# EAGLE design Pots (EAGLE 7.4.0)
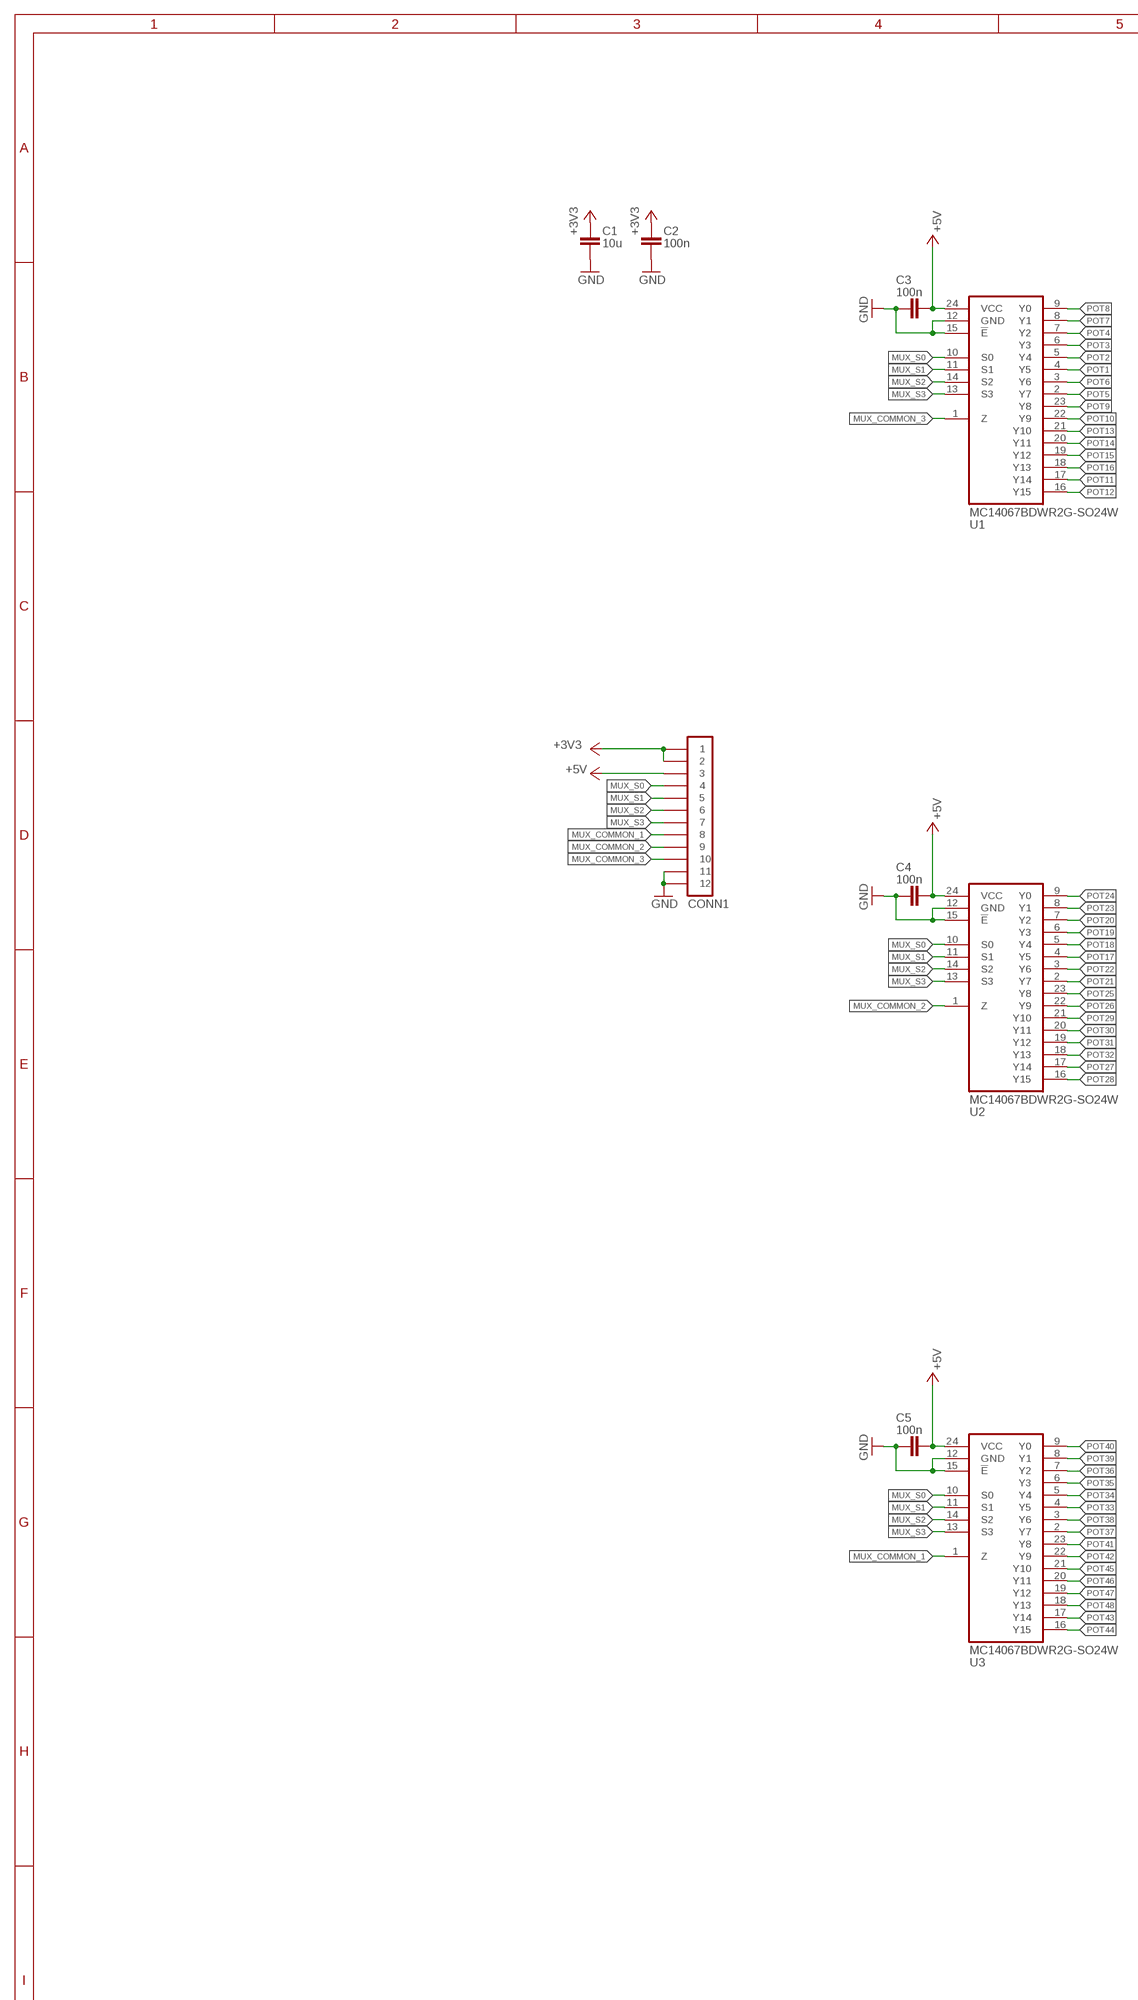
[diagram p0: schematic, sheet 1, part 1 of 2]
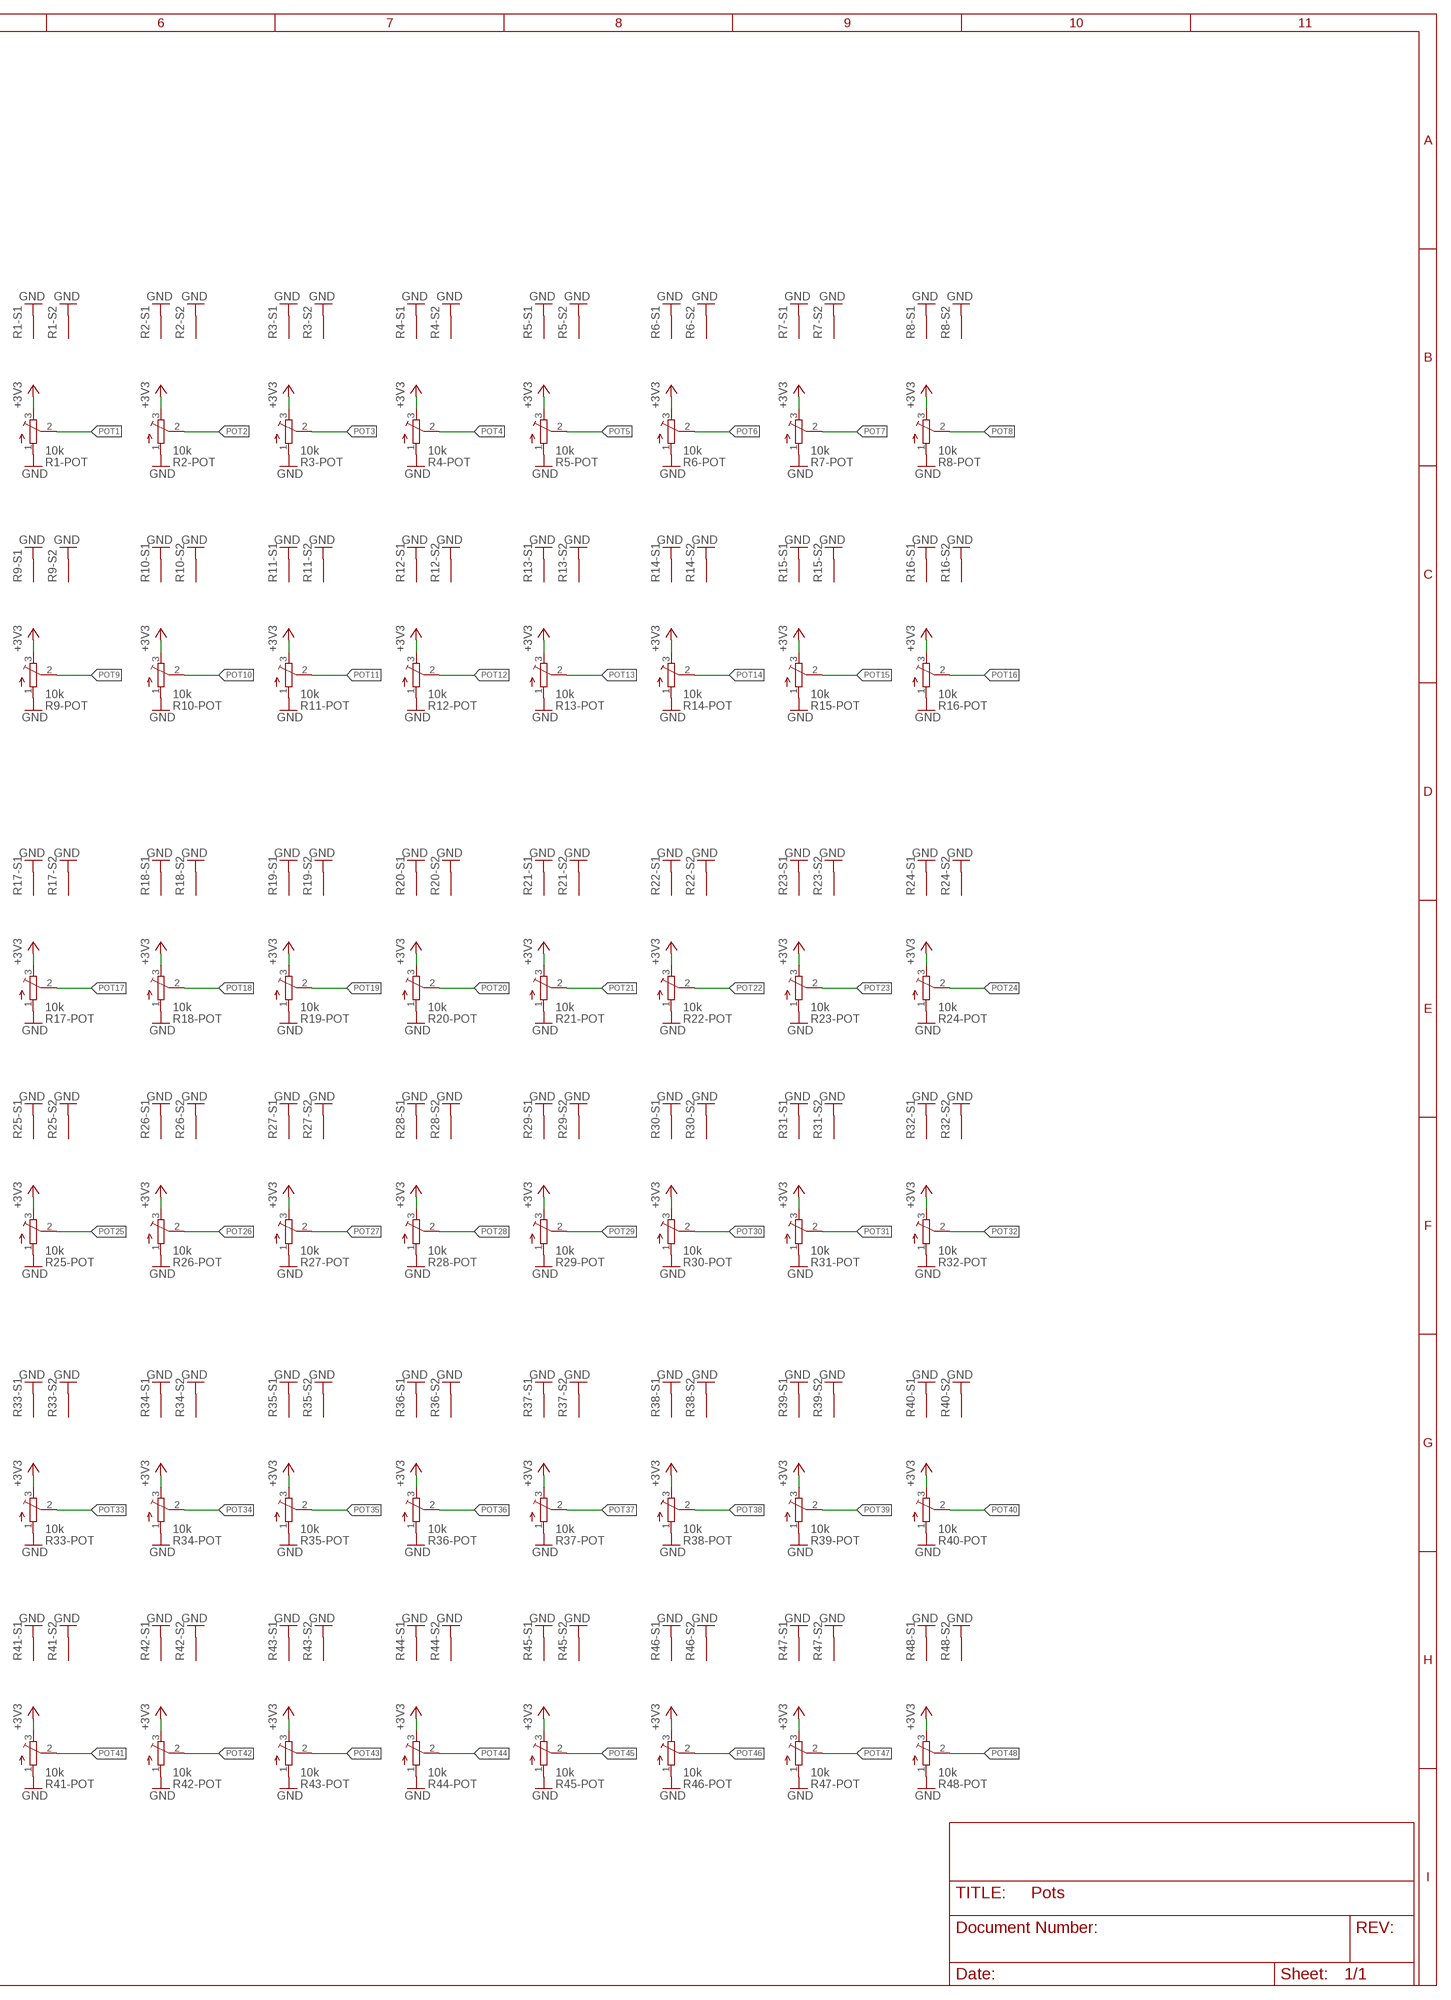
[diagram p1: schematic, sheet 1, part 2 of 2]

## Parts
C1  10u  CAPACITOR-0805  [C0805]
C2  100n  CAPACITOR-0805  [C0805]
C3  100n  CAPACITOR-0805  [C0805]
C4  100n  CAPACITOR-0805  [C0805]
C5  100n  CAPACITOR-0805  [C0805]
CONN1  PINHD-1X12-SMD  [MOLEX-52271-1279]
R1  10k  PTV09A-4025F-B103  [PTV09A-4025F-B103]
R2  10k  PTV09A-4025F-B103  [PTV09A-4025F-B103]
R3  10k  PTV09A-4025F-B103  [PTV09A-4025F-B103]
R4  10k  PTV09A-4025F-B103  [PTV09A-4025F-B103]
R5  10k  PTV09A-4025F-B103  [PTV09A-4025F-B103]
R6  10k  PTV09A-4025F-B103  [PTV09A-4025F-B103]
R7  10k  PTV09A-4025F-B103  [PTV09A-4025F-B103]
R8  10k  PTV09A-4025F-B103  [PTV09A-4025F-B103]
R9  10k  PTV09A-4025F-B103  [PTV09A-4025F-B103]
R10  10k  PTV09A-4025F-B103  [PTV09A-4025F-B103]
R11  10k  PTV09A-4025F-B103  [PTV09A-4025F-B103]
R12  10k  PTV09A-4025F-B103  [PTV09A-4025F-B103]
R13  10k  PTV09A-4025F-B103  [PTV09A-4025F-B103]
R14  10k  PTV09A-4025F-B103  [PTV09A-4025F-B103]
R15  10k  PTV09A-4025F-B103  [PTV09A-4025F-B103]
R16  10k  PTV09A-4025F-B103  [PTV09A-4025F-B103]
R17  10k  PTV09A-4025F-B103  [PTV09A-4025F-B103]
R18  10k  PTV09A-4025F-B103  [PTV09A-4025F-B103]
R19  10k  PTV09A-4025F-B103  [PTV09A-4025F-B103]
R20  10k  PTV09A-4025F-B103  [PTV09A-4025F-B103]
R21  10k  PTV09A-4025F-B103  [PTV09A-4025F-B103]
R22  10k  PTV09A-4025F-B103  [PTV09A-4025F-B103]
R23  10k  PTV09A-4025F-B103  [PTV09A-4025F-B103]
R24  10k  PTV09A-4025F-B103  [PTV09A-4025F-B103]
R25  10k  PTV09A-4025F-B103  [PTV09A-4025F-B103]
R26  10k  PTV09A-4025F-B103  [PTV09A-4025F-B103]
R27  10k  PTV09A-4025F-B103  [PTV09A-4025F-B103]
R28  10k  PTV09A-4025F-B103  [PTV09A-4025F-B103]
R29  10k  PTV09A-4025F-B103  [PTV09A-4025F-B103]
R30  10k  PTV09A-4025F-B103  [PTV09A-4025F-B103]
R31  10k  PTV09A-4025F-B103  [PTV09A-4025F-B103]
R32  10k  PTV09A-4025F-B103  [PTV09A-4025F-B103]
R33  10k  PTV09A-4025F-B103  [PTV09A-4025F-B103]
R34  10k  PTV09A-4025F-B103  [PTV09A-4025F-B103]
R35  10k  PTV09A-4025F-B103  [PTV09A-4025F-B103]
R36  10k  PTV09A-4025F-B103  [PTV09A-4025F-B103]
R37  10k  PTV09A-4025F-B103  [PTV09A-4025F-B103]
R38  10k  PTV09A-4025F-B103  [PTV09A-4025F-B103]
R39  10k  PTV09A-4025F-B103  [PTV09A-4025F-B103]
R40  10k  PTV09A-4025F-B103  [PTV09A-4025F-B103]
R41  10k  PTV09A-4025F-B103  [PTV09A-4025F-B103]
R42  10k  PTV09A-4025F-B103  [PTV09A-4025F-B103]
R43  10k  PTV09A-4025F-B103  [PTV09A-4025F-B103]
R44  10k  PTV09A-4025F-B103  [PTV09A-4025F-B103]
R45  10k  PTV09A-4025F-B103  [PTV09A-4025F-B103]
R46  10k  PTV09A-4025F-B103  [PTV09A-4025F-B103]
R47  10k  PTV09A-4025F-B103  [PTV09A-4025F-B103]
R48  10k  PTV09A-4025F-B103  [PTV09A-4025F-B103]
U1  MC14067BDWR2G-SO24W  [SO24-W]
U2  MC14067BDWR2G-SO24W  [SO24-W]
U3  MC14067BDWR2G-SO24W  [SO24-W]

## Nets
+3V3: C1.1 C2.1 CONN1.1 CONN1.2 R1.3 R2.3 R3.3 R4.3 R5.3 R6.3 R7.3 R8.3 R9.3 R10.3 R11.3 R12.3 R13.3 R14.3 R15.3 R16.3 R17.3 R18.3 R19.3 R20.3 R21.3 R22.3 R23.3 R24.3 R25.3 R26.3 R27.3 R28.3 R29.3 R30.3 R31.3 R32.3 R33.3 R34.3 R35.3 R36.3 R37.3 R38.3 R39.3 R40.3 R41.3 R42.3 R43.3 R44.3 R45.3 R46.3 R47.3 R48.3
+5V: C3.2 C4.2 C5.2 CONN1.3 U1.24(VCC) U2.24(VCC) U3.24(VCC)
GND: C1.2 C2.2 C3.1 C4.1 C5.1 CONN1.11 CONN1.12 R1.1 R1.S1(-S1:S) R1.S2(-S2:S) R2.1 R2.S1(-S1:S) R2.S2(-S2:S) R3.1 R3.S1(-S1:S) R3.S2(-S2:S) R4.1 R4.S1(-S1:S) R4.S2(-S2:S) R5.1 R5.S1(-S1:S) R5.S2(-S2:S) R6.1 R6.S1(-S1:S) R6.S2(-S2:S) R7.1 R7.S1(-S1:S) R7.S2(-S2:S) R8.1 R8.S1(-S1:S) R8.S2(-S2:S) R9.1 R9.S1(-S1:S) R9.S2(-S2:S) R10.1 R10.S1(-S1:S) R10.S2(-S2:S) R11.1 R11.S1(-S1:S) R11.S2(-S2:S) R12.1 R12.S1(-S1:S) R12.S2(-S2:S) R13.1 R13.S1(-S1:S) R13.S2(-S2:S) R14.1 R14.S1(-S1:S) R14.S2(-S2:S) R15.1 R15.S1(-S1:S) R15.S2(-S2:S) R16.1 R16.S1(-S1:S) R16.S2(-S2:S) R17.1 R17.S1(-S1:S) R17.S2(-S2:S) R18.1 R18.S1(-S1:S) R18.S2(-S2:S) R19.1 R19.S1(-S1:S) R19.S2(-S2:S) R20.1 R20.S1(-S1:S) R20.S2(-S2:S) R21.1 R21.S1(-S1:S) R21.S2(-S2:S) R22.1 R22.S1(-S1:S) R22.S2(-S2:S) R23.1 R23.S1(-S1:S) R23.S2(-S2:S) R24.1 R24.S1(-S1:S) R24.S2(-S2:S) R25.1 R25.S1(-S1:S) R25.S2(-S2:S) R26.1 R26.S1(-S1:S) R26.S2(-S2:S) R27.1 R27.S1(-S1:S) R27.S2(-S2:S) R28.1 R28.S1(-S1:S) R28.S2(-S2:S) R29.1 R29.S1(-S1:S) R29.S2(-S2:S) R30.1 R30.S1(-S1:S) R30.S2(-S2:S) R31.1 R31.S1(-S1:S) R31.S2(-S2:S) R32.1 R32.S1(-S1:S) R32.S2(-S2:S) R33.1 R33.S1(-S1:S) R33.S2(-S2:S) R34.1 R34.S1(-S1:S) R34.S2(-S2:S) R35.1 R35.S1(-S1:S) R35.S2(-S2:S) R36.1 R36.S1(-S1:S) R36.S2(-S2:S) R37.1 R37.S1(-S1:S) R37.S2(-S2:S) R38.1 R38.S1(-S1:S) R38.S2(-S2:S) R39.1 R39.S1(-S1:S) R39.S2(-S2:S) R40.1 R40.S1(-S1:S) R40.S2(-S2:S) R41.1 R41.S1(-S1:S) R41.S2(-S2:S) R42.1 R42.S1(-S1:S) R42.S2(-S2:S) R43.1 R43.S1(-S1:S) R43.S2(-S2:S) R44.1 R44.S1(-S1:S) R44.S2(-S2:S) R45.1 R45.S1(-S1:S) R45.S2(-S2:S) R46.1 R46.S1(-S1:S) R46.S2(-S2:S) R47.1 R47.S1(-S1:S) R47.S2(-S2:S) R48.1 R48.S1(-S1:S) R48.S2(-S2:S) U1.12(GND) U1.15(!E) U2.12(GND) U2.15(!E) U3.12(GND) U3.15(!E)
MUX_COMMON_1: CONN1.8 U3.1(Z)
MUX_COMMON_2: CONN1.9 U2.1(Z)
MUX_COMMON_3: CONN1.10 U1.1(Z)
MUX_S0: CONN1.4 U1.10(S0) U2.10(S0) U3.10(S0)
MUX_S1: CONN1.5 U1.11(S1) U2.11(S1) U3.11(S1)
MUX_S2: CONN1.6 U1.14(S2) U2.14(S2) U3.14(S2)
MUX_S3: CONN1.7 U1.13(S3) U2.13(S3) U3.13(S3)
POT1: R1.2 U1.4(Y5)
POT2: R2.2 U1.5(Y4)
POT3: R3.2 U1.6(Y3)
POT4: R4.2 U1.7(Y2)
POT5: R5.2 U1.2(Y7)
POT6: R6.2 U1.3(Y6)
POT7: R7.2 U1.8(Y1)
POT8: R8.2 U1.9(Y0)
POT9: R9.2 U1.23(Y8)
POT10: R10.2 U1.22(Y9)
POT11: R11.2 U1.17(Y14)
POT12: R12.2 U1.16(Y15)
POT13: R13.2 U1.21(Y10)
POT14: R14.2 U1.20(Y11)
POT15: R15.2 U1.19(Y12)
POT16: R16.2 U1.18(Y13)
POT17: R17.2 U2.4(Y5)
POT18: R18.2 U2.5(Y4)
POT19: R19.2 U2.6(Y3)
POT20: R20.2 U2.7(Y2)
POT21: R21.2 U2.2(Y7)
POT22: R22.2 U2.3(Y6)
POT23: R23.2 U2.8(Y1)
POT24: R24.2 U2.9(Y0)
POT25: R25.2 U2.23(Y8)
POT26: R26.2 U2.22(Y9)
POT27: R27.2 U2.17(Y14)
POT28: R28.2 U2.16(Y15)
POT29: R29.2 U2.21(Y10)
POT30: R30.2 U2.20(Y11)
POT31: R31.2 U2.19(Y12)
POT32: R32.2 U2.18(Y13)
POT33: R33.2 U3.4(Y5)
POT34: R34.2 U3.5(Y4)
POT35: R35.2 U3.6(Y3)
POT36: R36.2 U3.7(Y2)
POT37: R37.2 U3.2(Y7)
POT38: R38.2 U3.3(Y6)
POT39: R39.2 U3.8(Y1)
POT40: R40.2 U3.9(Y0)
POT41: R41.2 U3.23(Y8)
POT42: R42.2 U3.22(Y9)
POT43: R43.2 U3.17(Y14)
POT44: R44.2 U3.16(Y15)
POT45: R45.2 U3.21(Y10)
POT46: R46.2 U3.20(Y11)
POT47: R47.2 U3.19(Y12)
POT48: R48.2 U3.18(Y13)

## Library data of the parts
C1-C5 = igor_lbr:CAPACITOR: Capacitor
CONN1 = igor_lbr:PINHD-1X12: Pin header; MANUFACTURER: Molex; MPN: 52271-1279
R1-R48 = igor_lbr:PTV09A-4025F-B103: Potentiometer
U1-U3 = igor_lbr:MC14067BDWR2G: 16-Channel Analog Multiplexer/Demultiplexer; MANUFACTURER: ON Semiconductor; MPN: MC14067BDWR2G

## Board
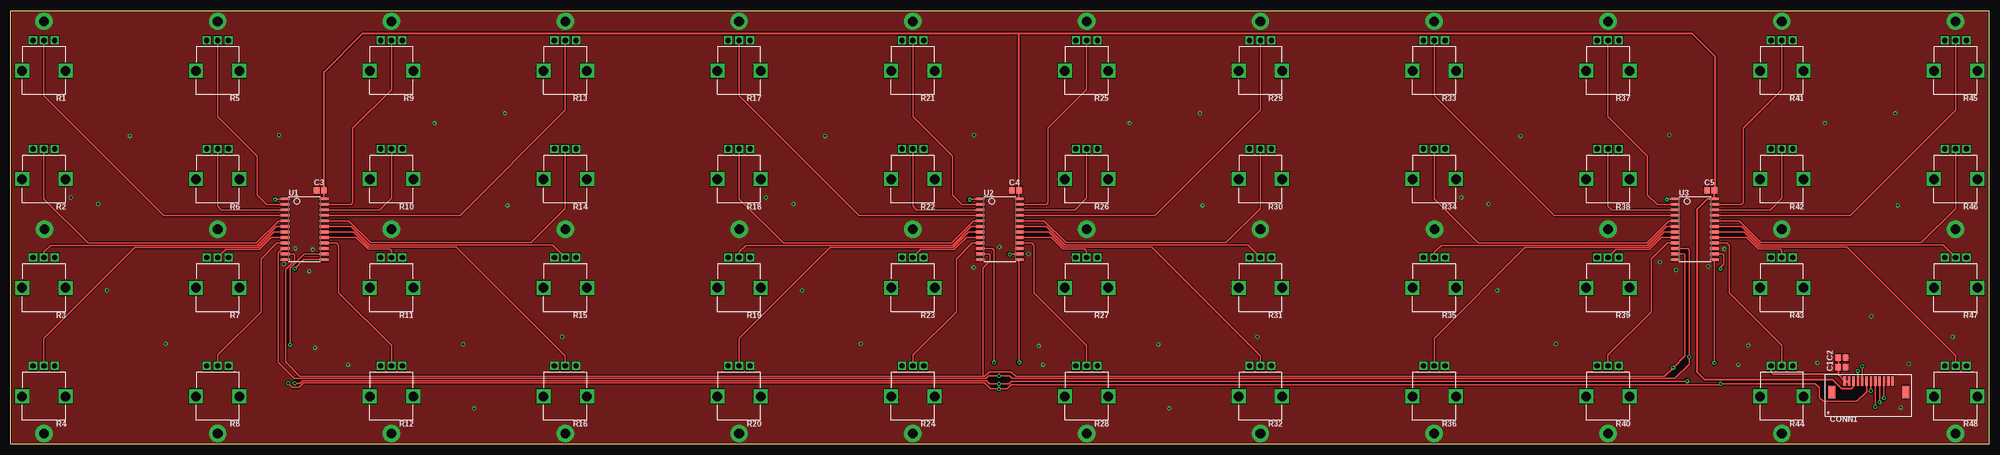
[diagram p2: board, top side]
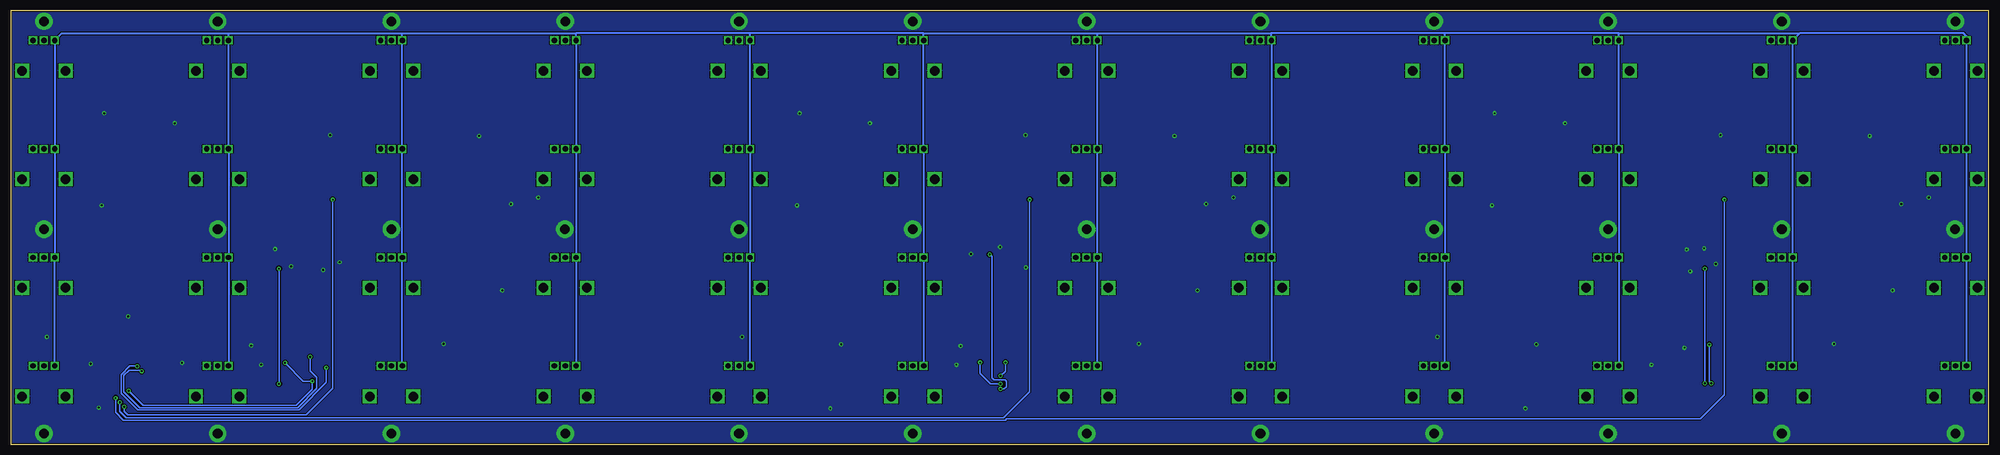
[diagram p3: board, bottom side, seen from below]

Size 455.2 x 99.8 mm. Coordinates in mm from the lower left corner, seen from the top.
Outline: 0,99.8 455.2,99.8 455.2,0 0,0 0,99.8
Copper layers (1*16): Top 0.035mm / dielectric 1.5mm / Bottom 0.035mm
Design rules "smiery": minimum track width 10mil, minimum drill 12mil, track to track 7mil, track to pad 5mil, pad to pad 5mil, via to via 6mil, smd to smd 0mil, copper to edge 12mil, drill to drill 10mil, minimum pad ring 13mil, minimum via ring 10mil, stop-mask expansion 2mil, vias tented up to drill 25mil, thermal gap 10mil

### Footprints (pad centres in the part's own frame; a part is rotated, then mirrored left to right if it is on the bottom)
C0805 = smd 1.3 x 1.5: 1 -0.85,0; 2 0.85,0
MOLEX-52271-1279 = smd 0.6 x 2.2: 1 -5.5,3.5; 2 -4.5,3.5; 3 -3.5,3.5; 4 -2.5,3.5; 5 -1.5,3.5; 6 -0.5,3.5; 7 0.5,3.5; 8 1.5,3.5; 9 2.5,3.5; 10 3.5,3.5; 11 4.5,3.5; 12 5.5,3.5 | smd 1.65 x 2.8: S1 -8.5,1; S2 8.5,1
PTV09A-4025F-B103 = drill 1.2 square: 1 -2.5,-7; 2 0,-7; 3 2.5,-7 | drill 2.2 square: S1 -5,0; S2 5,0
SO24-W = smd 2.032 x 0.6: 1 -4.475,6.985; 2 -4.475,5.715; 3 -4.475,4.445; 4 -4.475,3.175; 5 -4.475,1.905; 6 -4.475,0.635; 7 -4.475,-0.635; 8 -4.475,-1.905; 9 -4.475,-3.175; 10 -4.475,-4.445; 11 -4.475,-5.715; 12 -4.475,-6.985; 13 4.475,-6.985; 14 4.475,-5.715; 15 4.475,-4.445; 16 4.475,-3.175; 17 4.475,-1.905; 18 4.475,-0.635; 19 4.475,0.635; 20 4.475,1.905; 21 4.475,3.175; 22 4.475,4.445; 23 4.475,5.715; 24 4.475,6.985

### Placement (x,y rotation side)
C1  421.4,17.7 0 top
C2  421.4,19.9 0 top
C3  71.23,58.49 0 top
C4  231.23,58.49 0 top
C5  391.23,58.49 0 top
CONN1  427.6,11 0 top
R1  7.6,86 180 top
R2  7.6,61 180 top
R3  7.6,36 180 top
R4  7.6,11 180 top
R5  47.6,86 180 top
R6  47.6,61 180 top
R7  47.6,36 180 top
R8  47.6,11 180 top
R9  87.6,86 180 top
R10  87.6,61 180 top
R11  87.6,36 180 top
R12  87.6,11 180 top
R13  127.6,86 180 top
R14  127.6,61 180 top
R15  127.6,36 180 top
R16  127.6,11 180 top
R17  167.6,86 180 top
R18  167.6,61 180 top
R19  167.6,36 180 top
R20  167.6,11 180 top
R21  207.6,86 180 top
R22  207.6,61 180 top
R23  207.6,36 180 top
R24  207.6,11 180 top
R25  247.6,86 180 top
R26  247.6,61 180 top
R27  247.6,36 180 top
R28  247.6,11 180 top
R29  287.6,86 180 top
R30  287.6,61 180 top
R31  287.6,36 180 top
R32  287.6,11 180 top
R33  327.6,86 180 top
R34  327.6,61 180 top
R35  327.6,36 180 top
R36  327.6,11 180 top
R37  367.6,86 180 top
R38  367.6,61 180 top
R39  367.6,36 180 top
R40  367.6,11 180 top
R41  407.6,86 180 top
R42  407.6,61 180 top
R43  407.6,36 180 top
R44  407.6,11 180 top
R45  447.6,86 180 top
R46  447.6,61 180 top
R47  447.6,36 180 top
R48  447.6,11 180 top
U1  67.6,49.5 0 top
U2  227.6,49.5 0 top
U3  387.6,49.5 0 top

### Tracks (layer width: path | path; a pad name or v marks a point on that pad's centre or on a via)
+3V3
  Top 0.406: CONN1.2 CONN1.1 420.55,16.05 | C2.1 C1.1 420.55,16.05 | R44.3 405.1,16.6 405.5,16.2 420.4,16.2 420.55,16.05
  Bottom 0.406: R4.3 R3.3 R2.3 R1.3 5.1,94 5.7,94.6 43.5,94.6 | R8.3 R7.3 R6.3 R5.3 43.5,94.6 | R12.3 R11.3 R10.3 R9.3 85.1,94.6 | 85.1,94.6 43.5,94.6 | R16.3 R15.3 R14.3 R13.3 125.1,94.6 | R20.3 R19.3 R18.3 R17.3 165.1,94.5 165.2,94.6 | R24.3 R23.3 R22.3 R21.3 205.1,94.6 | R28.3 R27.3 R26.3 R25.3 245.1,94.6 | 245.1,94.6 205.1,94.6 | 205.1,94.6 165.2,94.6 | R32.3 R31.3 R30.3 R29.3 285.1,94.5 285,94.6 | R36.3 R35.3 R34.3 R33.3 325.1,94.6 | R40.3 R39.3 R38.3 R37.3 365.1,94.6 | R44.3 R43.3 R42.3 R41.3 405.1,94.6 | 405.1,94.6 443.5,94.6 R45.3 R46.3 R47.3 R48.3 | 405.1,94.6 365.1,94.6 | 365.1,94.6 325.1,94.6 | 85.1,94.6 125.1,94.6 | 125.1,94.6 165.2,94.6 | 245.1,94.6 285,94.6 | 285,94.6 325.1,94.6
+5V
  Top 0.406: U1.24 C3.2 72.08,85.68 81,94.6 232,94.6 | U2.24 C4.2 232.08,94.52 232,94.6 | 232,94.6 386.9,94.6 392.2,89.3 392.2,58.61 C5.2 U3.24 390.49,56.48 388,54 388,16.7 389.8,14.9 419.2,14.9 421.3,12.8 423.7,12.8 424.1,13.2 CONN1.3
GND  (via drill 0.4 pad 0.6, 2.2 pad 4)
  other vias: 35.6,23.1 13.8,56.8 7.6,97.4 47.6,97.4 7.7,49.5 47.6,49.5 47.6,2.4 7.6,2.4 87.6,97.4 127.6,97.4 87.6,49.5 127.6,49.5 87.6,2.4 127.6,2.4 22.1,35.4 20.1,55.3 27.4,71 61.7,71.2 97.5,73.9 113.7,76.2 104.1,23 106.6,8.2 114.3,55 126.9,24.7 77.6,18.3 70,22.2 195.6,23.1 173.8,56.8 167.6,97.4 207.6,97.4 167.7,49.5 207.6,49.5 207.6,2.4 167.6,2.4 247.6,97.4 287.6,97.4 247.6,49.5 182.1,35.4 180.1,55.3 187.4,71 221.7,71.2 257.5,73.9 273.7,76.2 355.6,23.1 333.8,56.8 327.6,97.4 367.6,97.4 327.7,49.5 367.6,49.5 367.6,2.4 327.6,2.4 407.6,97.4 447.6,97.4 407.6,49.5 342.1,35.4 340.1,55.3 347.4,71 381.7,71.2 417.5,73.9 433.7,76.2 274.3,55 287.6,49.5 286.9,24.7 236.6,22.6 287.6,2.4 237.6,18.3 264.1,23 266.6,8.2 247.6,2.4 434.3,55 447.6,49.5 446.9,24.7 399.9,22.7 447.6,2.4 397.6,18.3 428.2,29.4 436.8,18.5 407.6,2.4 68.7,39.8 69.5,44.8 65.5,45.1 62.8,41.5 221.6,40.7 227.5,45.4 234.2,43.8 379.5,41.9 390.7,40.9 394.4,44.9 383.3,40.1 415.8,18.7 435,8.4
  pour Top (isolate 0.254): 0,99.8 455.2,99.8 455.2,0 0,0
  pour Bottom (isolate 0.254): 0,99.8 455.2,99.8 455.2,0 0,0
MUX_COMMON_1  (via drill 0.4 pad 0.6)
  Top 0.305: CONN1.8 v429.1,8.6 | U3.1 381.29,56.48 v381.1,56.3
  Bottom 0.305: v381.1,56.3 381.1,12.8 387.2,6.7 428.3,6.7 429.1,7.5 v429.1,8.6
MUX_COMMON_2  (via drill 0.4 pad 0.6)
  Top 0.305: U2.1 220.88,56.48 v220.7,56.3 | CONN1.9 v430.1,9.6
  Bottom 0.305: v220.7,56.3 220.7,12.1 226.7,6.1 428.6,6.1 430.1,7.6 v430.1,9.6
MUX_COMMON_3  (via drill 0.4 pad 0.6)
  Top 0.305: U1.1 60.98,56.48 v60.8,56.3 | CONN1.10 v431.1,10.6
  Bottom 0.305: v60.8,56.3 60.8,11.3 66.3,5.8 226,5.8 226.3,5.5 429.3,5.5 431.1,7.3 v431.1,10.6
MUX_S0  (via drill 0.4 pad 0.6)
  Top 0.305: U3.10 385.94,45.05 386.3,44.7 v386.3,20.1 386.3,18.4 383,15.1 230.4,15.1 229.8,15.7 v227.4,15.7 225,15.7 224.4,15.1 65.2,15.1 61.5,18.8 61.5,44 62.55,45.05 U1.10 | U2.10 225.94,45.05 226.3,44.7 v226.3,18.8 | v425.1,16.8 CONN1.4
  Bottom 0.305: v226.3,18.8 226.3,16.8 v227.4,15.7 | v386.3,20.1 386.3,16.9 384.8,15.4 384.8,12.8 389.2,8.4 425.5,8.4 429.2,12.1 429.2,15.8 428,17 425.3,17 v425.1,16.8
MUX_S1  (via drill 0.4 pad 0.6)
  Top 0.305: U1.11 65.11,43.78 65.3,43.6 65.3,42.3 63.2,40.2 63.2,18.9 66.5,15.6 223.7,15.6 | U2.11 225.12,43.78 225.3,43.6 225.3,42.2 223.7,40.6 223.7,15.6 | U3.11 385.12,43.78 385.3,43.6 385.3,20.3 v382.6,17.6 380.6,15.6 231.3,15.6 230.2,16.7 225.2,16.7 224.1,15.6 223.7,15.6 | v426.1,17.9 CONN1.5
  Bottom 0.305: v426.1,17.9 426.2,18 427.8,18 429.8,16 429.8,11.7 426,7.9 388.9,7.9 382.6,14.2 v382.6,17.6
MUX_S2  (via drill 0.4 pad 0.6)
  Top 0.305: U1.14 67.48,43.78 64.3,40.6 v64.3,22.9 | v63.8,14 64.7,13.1 66.4,13.1 67.4,14.1 224.1,14.1 225.5,12.7 v227.4,12.7 229.3,12.7 230.2,13.6 393.2,13.6 v393.5,13.9 415.3,13.9 416.2,13 416.2,10.7 417.1,9.8 424.9,9.8 427.1,12 CONN1.6 | v393.5,40.4 393.5,40.7 394.3,41.5 394.3,43.5 394.01,43.78 U3.14 | U2.14 229.99,43.78 v229.9,43.7
  Bottom 0.305: v64.3,22.9 64.3,14.5 v63.8,14 | v227.4,12.7 226.6,12.7 226.1,13.2 226.1,14.5 226.4,14.8 228.9,14.8 229.4,15.3 229.4,43.2 v229.9,43.7 | v393.5,13.9 v393.5,40.4
MUX_S3  (via drill 0.4 pad 0.6)
  Top 0.305: U2.13 232.07,18.82 v232.1,18.8 | U1.13 67.42,42.52 v65.3,40.4 | v65.3,14 66.6,14 67.2,14.6 224.5,14.6 225.2,13.9 v227.4,13.9 229.7,13.9 230.3,14.5 v385.8,14.5 | v392.1,18.7 392.1,42.49 U3.13 | CONN1.7 v428.1,12.3
  Bottom 0.305: v65.3,40.4 v65.3,14 | v232.1,18.8 232.1,16.3 229.7,13.9 v227.4,13.9 | v392.1,18.7 387.9,14.5 v385.8,14.5 385.8,12.6 389.5,8.9 424.7,8.9 v428.1,12.3
POT1
  Top 0.305: U1.4 35.23,52.67 7.6,80.3 R1.2
POT2
  Top 0.305: U1.5 61.6,51.41 56.5,46.3 17.8,46.3 7.6,56.5 R2.2
POT3
  Top 0.305: U1.6 61.03,50.13 56.7,45.8 9.2,45.8 7.6,44.2 R3.2
POT4
  Top 0.305: U1.7 60.47,48.87 56.9,45.3 28.5,45.3 7.6,24.4 R4.2
POT5
  Top 0.305: U1.2 63.11,55.2 58.9,55.2 56.7,57.4 56.7,66.3 47.6,75.4 R5.2
POT6
  Top 0.305: U1.3 48.45,53.95 47.6,54.8 R6.2
POT7
  Top 0.305: U1.8 59.9,47.59 57.1,44.8 49.4,44.8 R7.2
POT8
  Top 0.305: U1.9 61.23,46.33 57.6,42.7 57.6,30.5 47.6,20.5 R8.2
POT9
  Top 0.305: U1.23 78.31,55.22 78.7,55.6 78.7,72.8 87.6,81.7 R9.2
POT10
  Top 0.305: U1.22 84.9,53.95 87.6,56.65 R10.2
POT11
  Top 0.305: U1.17 79.5,47.6 82.2,44.9 87.2,44.9 87.6,44.5 R11.2
POT12
  Top 0.305: R12.2 87.6,22.7 75.5,34.8 75.5,45.8 74.97,46.33 U1.16
POT13
  Top 0.305: U1.21 103.38,52.67 127.6,76.9 R13.2
POT14
  Top 0.305: U1.20 77.8,51.41 82.8,46.4 119.7,46.4 125.3,52 127.6,54.3 R14.2
POT15
  Top 0.305: U1.19 78.36,50.13 82.6,45.9 124.7,45.9 R15.2
POT16
  Top 0.305: U1.18 78.94,48.87 82.4,45.4 102.5,45.4 127.6,20.3 R16.2
POT17
  Top 0.305: U2.4 195.22,52.67 167.6,80.3 R17.2
POT18
  Top 0.305: U2.5 221.6,51.41 216.5,46.3 177.8,46.3 167.6,56.5 R18.2
POT19
  Top 0.305: U2.6 221.03,50.13 216.7,45.8 169.2,45.8 167.6,44.2 R19.2
POT20
  Top 0.305: U2.7 220.47,48.87 216.9,45.3 188.5,45.3 167.6,24.4 R20.2
POT21
  Top 0.305: U2.2 223.11,55.2 218.9,55.2 216.7,57.4 216.7,66.3 207.6,75.4 R21.2
POT22
  Top 0.305: U2.3 208.46,53.95 207.6,54.8 R22.2
POT23
  Top 0.305: U2.8 219.9,47.59 217.1,44.8 209.4,44.8 R23.2
POT24
  Top 0.305: U2.9 221.22,46.33 217.6,42.7 217.6,30.5 207.6,20.5 R24.2
POT25
  Top 0.305: U2.23 238.31,55.22 238.7,55.6 238.7,72.8 247.6,81.7 R25.2
POT26
  Top 0.305: U2.22 244.9,53.95 247.6,56.65 R26.2
POT27
  Top 0.305: U2.17 239.5,47.6 242.2,44.9 247.2,44.9 247.6,44.5 R27.2
POT28
  Top 0.305: R28.2 247.6,22.7 235.5,34.8 235.5,45.8 234.97,46.33 U2.16
POT29
  Top 0.305: U2.21 263.38,52.67 287.6,76.9 R29.2
POT30
  Top 0.305: U2.20 237.79,51.41 242.8,46.4 279.7,46.4 287.6,54.3 R30.2
POT31
  Top 0.305: U2.19 238.37,50.13 242.6,45.9 284.7,45.9 R31.2
POT32
  Top 0.305: U2.18 238.94,48.87 242.4,45.4 262.5,45.4 287.6,20.3 R32.2
POT33
  Top 0.305: U3.4 355.23,52.67 327.6,80.3 R33.2
POT34
  Top 0.305: U3.5 381.61,51.41 376.5,46.3 337.8,46.3 327.6,56.5 R34.2
POT35
  Top 0.305: U3.6 381.04,50.13 376.7,45.8 329.2,45.8 327.6,44.2 R35.2
POT36
  Top 0.305: U3.7 380.46,48.87 376.9,45.3 348.5,45.3 327.6,24.4 R36.2
POT37
  Top 0.305: U3.2 383.11,55.2 378.9,55.2 376.7,57.4 376.7,66.3 367.6,75.4 R37.2
POT38
  Top 0.305: U3.3 368.45,53.95 367.6,54.8 R38.2
POT39
  Top 0.305: U3.8 379.89,47.59 377.1,44.8 369.4,44.8 R39.2
POT40
  Top 0.305: U3.9 381.23,46.33 377.6,42.7 377.6,30.5 367.6,20.5 R40.2
POT41
  Top 0.305: U3.23 398.31,55.22 398.7,55.6 398.7,72.8 407.6,81.7 R41.2
POT42
  Top 0.305: U3.22 404.9,53.95 407.6,56.65 R42.2
POT43
  Top 0.305: U3.17 399.5,47.6 402.2,44.9 407.2,44.9 407.6,44.5 R43.2
POT44
  Top 0.305: R44.2 407.6,22.7 395.5,34.8 395.5,45.8 394.98,46.33 U3.16
POT45
  Top 0.305: U3.21 423.38,52.67 447.6,76.9 R45.2
POT46
  Top 0.305: U3.20 397.8,51.41 402.8,46.4 439.7,46.4 447.6,54.3 R46.2
POT47
  Top 0.305: U3.19 398.37,50.13 402.6,45.9 444.7,45.9 R47.2
POT48
  Top 0.305: U3.18 398.94,48.87 402.4,45.4 422.5,45.4 447.6,20.3 R48.2